# Altium schematic sheet Wifi-ESP32.SchDoc
size A4
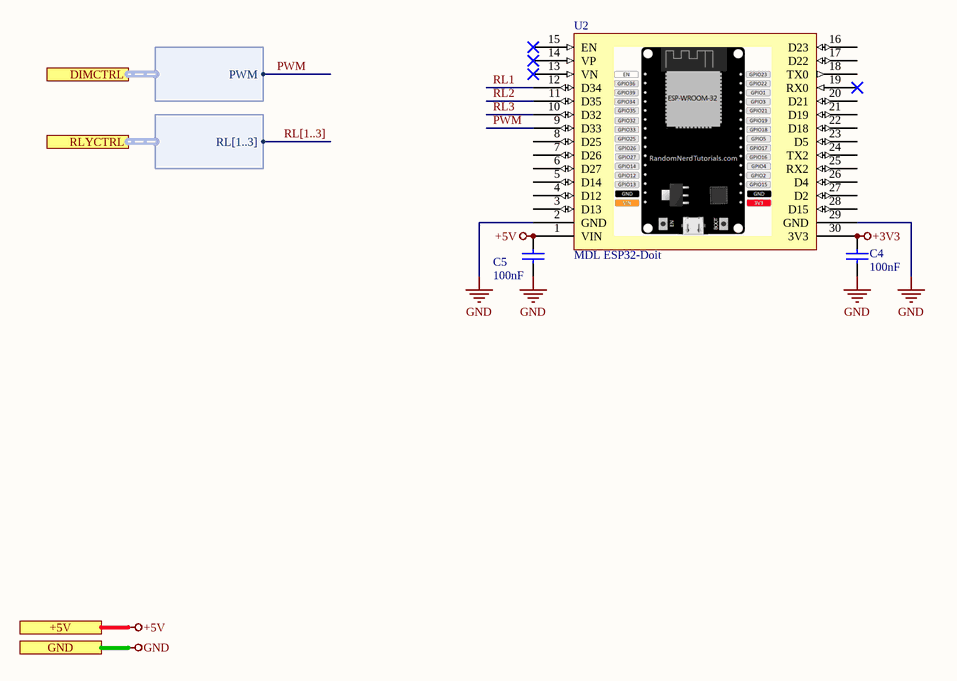
[diagram p0: Wifi-ESP32.SchDoc]

## Parts
C4  value 100nF  [C-0805]  (hidden comment: 104)
C5  value 100nF  [C-0805]  (hidden comment: 104)
U2  MDL ESP32-Doit  [MDL-ESP32-DOIT]

## Ports
+5V, DIMCTRL (harness DIMCTRL), GND, RLYCTRL (harness RLYCTRL)

## Harnesses
DIMCTRL: PWM
RLYCTRL: RL[1..3]

## Nets
+3V3: C4.1 U2.30(3V3)
+5V: C5.1 U2.1(VIN) ; port +5V
GND: C4.2 C5.2 U2.2(GND) U2.29(GND) ; port GND
PWM: U2.9(D33) ; port DIMCTRL.PWM
RL1: U2.12(D34)
RL2: U2.11(D35)
RL3: U2.10(D32)

Not connected (* = marked no-connect by the designer): U2 3(D13) 4(D12) 5(D14) 6(D27) 7(D26) 8(D25) 13(VN)* 14(VP)* 15(EN)* 16(D23) 17(D22) 18(TX0) 19(RX0)* 20(D21) 21(D19) 22(D18) 23(D5) 24(TX2) 25(RX2) 26(D4) 27(D2) 28(D15)

## Buses and harness runs
bus RL[1..3]

## Library data of the parts
C4 C5 = Cap: Capacitor; Published: 8-Jun-2000; LatestRevisionDate: 17-Jul-2002; LatestRevisionNote: Re-released for DXP Platform.; PackageReference: RAD-0.3; Publisher: Altium Limited
U2 = MDL ESP32-Doit: ESP32 DEVKIT V1 DOIT; ComponentLink1Description: Wiki; ComponentLink1URL: https://docs.zerynth.com/latest/official/board.zerynth.doit_esp32/docs/index.html; ComponentLink2Description: PinOut; ComponentLink2URL: https://randomnerdtutorials.com/getting-started-with-esp32/